# Altium project LED板10通道.PrjPCB
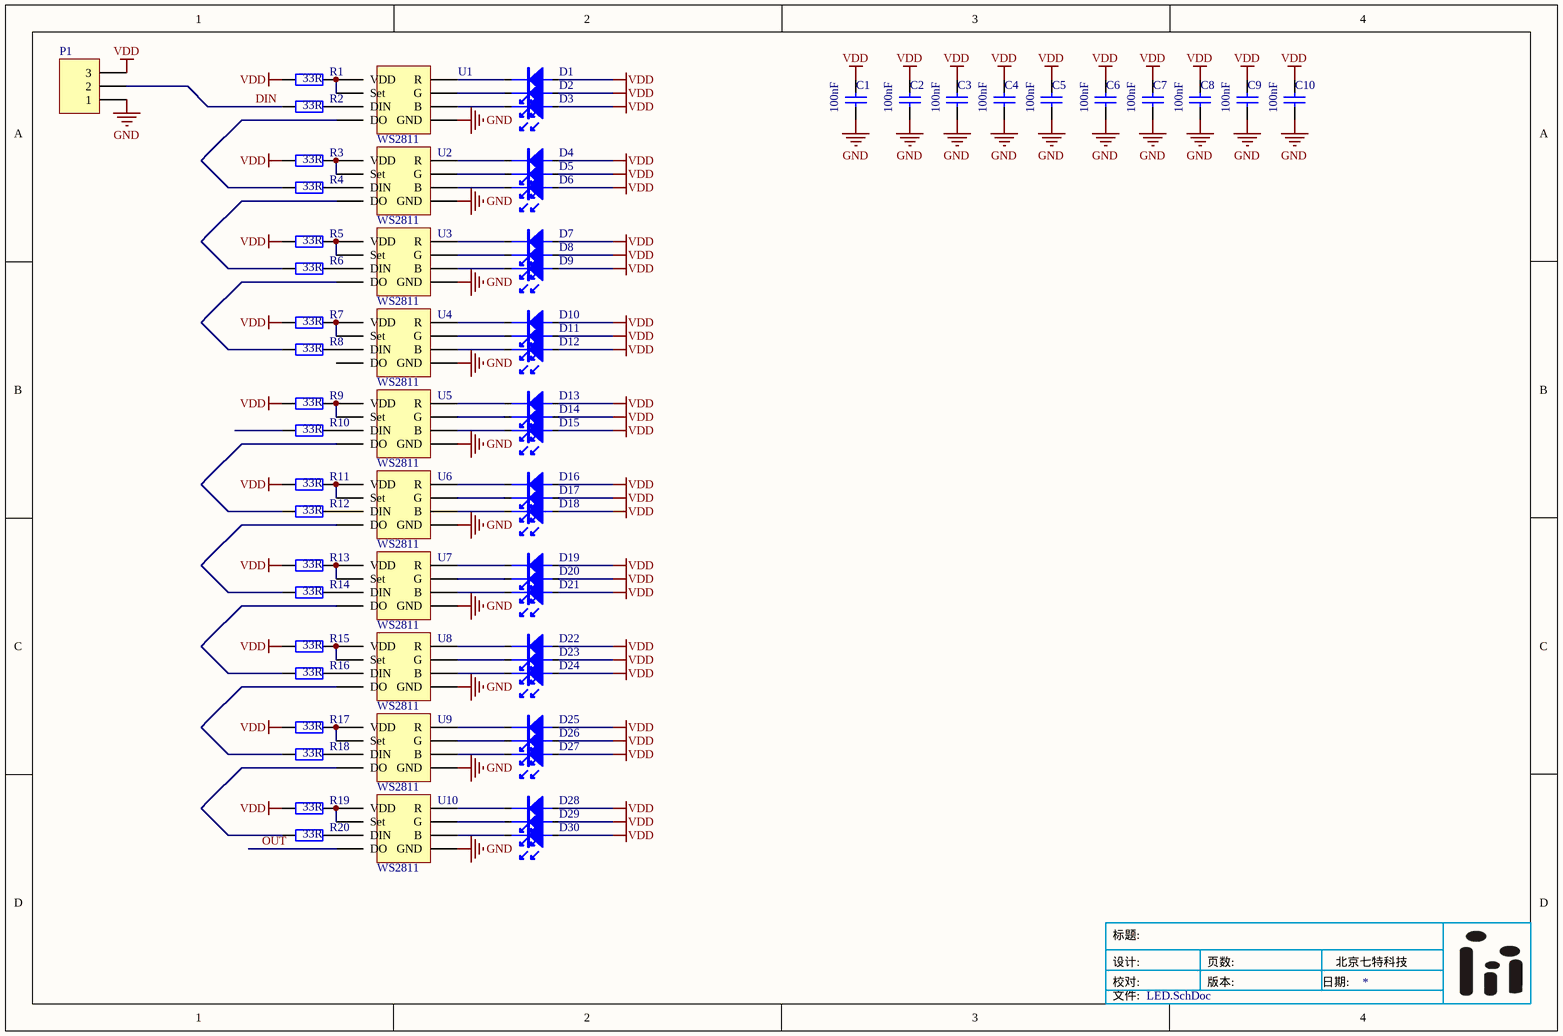
[diagram p0: LED.SchDoc]
1 sheet, 71 parts. Net scope: global (net labels, ports and power ports of the same name join across sheets).
Board file: LED板10通道.PcbDoc

## Sheet LED.SchDoc
size A4

### Parts
C1  100nF  [1608C]
C2  100nF  [1608C]
C3  100nF  [1608C]
C4  100nF  [1608C]
C5  100nF  [1608C]
C6  100nF  [1608C]
C7  100nF  [1608C]
C8  100nF  [1608C]
C9  100nF  [1608C]
C10  100nF  [1608C]
D1  (no value)  [LEDN/5S]
D2  (no value)  [LEDN/5S]
D3  (no value)  [LEDN/5S]
D4  (no value)  [LEDN/5S]
D5  (no value)  [LEDN/5S]
D6  (no value)  [LEDN/5S]
D7  (no value)  [LEDN/5S]
D8  (no value)  [LEDN/5S]
D9  (no value)  [LEDN/5S]
D10  (no value)  [LEDN/5S]
D11  (no value)  [LEDN/5S]
D12  (no value)  [LEDN/5S]
D13  (no value)  [LEDN/5S]
D14  (no value)  [LEDN/5S]
D15  (no value)  [LEDN/5S]
D16  (no value)  [LEDN/5S]
D17  (no value)  [LEDN/5S]
D18  (no value)  [LEDN/5S]
D19  (no value)  [LEDN/5S]
D20  (no value)  [LEDN/5S]
D21  (no value)  [LEDN/5S]
D22  (no value)  [LEDN/5S]
D23  (no value)  [LEDN/5S]
D24  (no value)  [LEDN/5S]
D25  (no value)  [LEDN/5S]
D26  (no value)  [LEDN/5S]
D27  (no value)  [LEDN/5S]
D28  (no value)  [LEDN/5S]
D29  (no value)  [LEDN/5S]
D30  (no value)  [LEDN/5S]
P1  (no value)  [5264-3]
R1  33R  [1608]
R2  33R  [1608]
R3  33R  [1608]
R4  33R  [1608]
R5  33R  [1608]
R6  33R  [1608]
R7  33R  [1608]
R8  33R  [1608]
R9  33R  [1608]
R10  33R  [1608]
R11  33R  [1608]
R12  33R  [1608]
R13  33R  [1608]
R14  33R  [1608]
R15  33R  [1608]
R16  33R  [1608]
R17  33R  [1608]
R18  33R  [1608]
R19  33R  [1608]
R20  33R  [1608]
U1  WS2811  [so8]
U2  WS2811  [so8]
U3  WS2811  [so8]
U4  WS2811  [so8]
U5  WS2811  [so8]
U6  WS2811  [so8]
U7  WS2811  [so8]
U8  WS2811  [so8]
U9  WS2811  [so8]
U10  WS2811  [so8]

### Nets
GND: C1.1 C2.1 C3.1 C4.1 C5.1 C6.1 C7.1 C8.1 C9.1 C10.1 P1.1 U1.4(GND) U2.4(GND) U3.4(GND) U4.4(GND) U5.4(GND) U6.4(GND) U7.4(GND) U8.4(GND) U9.4(GND) U10.4(GND)
VDD: C1.2 C2.2 C3.2 C4.2 C5.2 C6.2 C7.2 C8.2 C9.2 C10.2 D1.1 D2.1 D3.1 D4.1 D5.1 D6.1 D7.1 D8.1 D9.1 D10.1 D11.1 D12.1 D13.1 D14.1 D15.1 D16.1 D17.1 D18.1 D19.1 D20.1 D21.1 D22.1 D23.1 D24.1 D25.1 D26.1 D27.1 D28.1 D29.1 D30.1 P1.3 R1.2 R3.2 R5.2 R7.2 R9.2 R11.2 R13.2 R15.2 R17.2 R19.2
DIN: P1.2 R2.2
OUT: U10.5(DO)
NetD1_2: D1.2 U1.1(R)
NetD2_2: D2.2 U1.2(G)
NetD3_2: D3.2 U1.3(B)
NetD4_2: D4.2 U2.1(R)
NetD5_2: D5.2 U2.2(G)
NetD6_2: D6.2 U2.3(B)
NetD7_2: D7.2 U3.1(R)
NetD8_2: D8.2 U3.2(G)
NetD9_2: D9.2 U3.3(B)
NetD10_2: D10.2 U4.1(R)
NetD11_2: D11.2 U4.2(G)
NetD12_2: D12.2 U4.3(B)
NetD13_2: D13.2 U5.1(R)
NetD14_2: D14.2 U5.2(G)
NetD15_2: D15.2 U5.3(B)
NetD16_2: D16.2 U6.1(R)
NetD17_2: D17.2 U6.2(G)
NetD18_2: D18.2 U6.3(B)
NetD19_2: D19.2 U7.1(R)
NetD20_2: D20.2 U7.2(G)
NetD21_2: D21.2 U7.3(B)
NetD22_2: D22.2 U8.1(R)
NetD23_2: D23.2 U8.2(G)
NetD24_2: D24.2 U8.3(B)
NetD25_2: D25.2 U9.1(R)
NetD26_2: D26.2 U9.2(G)
NetD27_2: D27.2 U9.3(B)
NetD28_2: D28.2 U10.1(R)
NetD29_2: D29.2 U10.2(G)
NetD30_2: D30.2 U10.3(B)
NetR1_1: R1.1 U1.7(Set) U1.8(VDD)
NetR2_1: R2.1 U1.6(DIN)
NetR3_1: R3.1 U2.7(Set) U2.8(VDD)
NetR4_1: R4.1 U2.6(DIN)
NetR4_2: R4.2 U1.5(DO)
NetR5_1: R5.1 U3.7(Set) U3.8(VDD)
NetR6_1: R6.1 U3.6(DIN)
NetR6_2: R6.2 U2.5(DO)
NetR7_1: R7.1 U4.7(Set) U4.8(VDD)
NetR8_1: R8.1 U4.6(DIN)
NetR8_2: R8.2 U3.5(DO)
NetR9_1: R9.1 U5.7(Set) U5.8(VDD)
NetR10_1: R10.1 U5.6(DIN)
NetR11_1: R11.1 U6.7(Set) U6.8(VDD)
NetR12_1: R12.1 U6.6(DIN)
NetR12_2: R12.2 U5.5(DO)
NetR13_1: R13.1 U7.7(Set) U7.8(VDD)
NetR14_1: R14.1 U7.6(DIN)
NetR14_2: R14.2 U6.5(DO)
NetR15_1: R15.1 U8.7(Set) U8.8(VDD)
NetR16_1: R16.1 U8.6(DIN)
NetR16_2: R16.2 U7.5(DO)
NetR17_1: R17.1 U9.7(Set) U9.8(VDD)
NetR18_1: R18.1 U9.6(DIN)
NetR18_2: R18.2 U8.5(DO)
NetR19_1: R19.1 U10.7(Set) U10.8(VDD)
NetR20_1: R20.1 U10.6(DIN)
NetR20_2: R20.2 U9.5(DO)

Not connected (* = marked no-connect by the designer): R10 2; U4 5(DO)

### Notes on the sheet
- 标题:
- 设计:
- 校对:
- 页数:
- 版本:
- 日期:
- 北京七特科技
- 文件:

### Library data of the parts
C1-C10 = Cap: Capacitor; Published: 8-Jun-2000; LatestRevisionDate: 17-Jul-2002; LatestRevisionNote: Re-released for DXP Platform.; PackageReference: RAD-0.3; Publisher: Altium Limited; Value: 100nF
D1-D30 = LED
P1 = Header 3: Header, 3-Pin; LatestRevisionDate: 17-Jul-2002; LatestRevisionNote: Re-released for DXP Platform.; Publisher: Altium Limited
R1-R20 = Res2: Resistor; Value: 220R; Published: 8-Jun-2000; LatestRevisionDate: 17-Jul-2002; LatestRevisionNote: Re-released for DXP Platform.; PackageReference: AXIAL-0.4; Publisher: Altium Limited
U1-U10 = Header 4X2: Header, 4-Pin, Dual row; LatestRevisionDate: 17-Jul-2002; LatestRevisionNote: Re-released for DXP Platform.; Publisher: Altium Limited